# Altium schematic sheet Cpcis_connectors_P1_P2_P3.SchDoc: CPCIS Backplane
size 420 x 297 mm; CheckedBy: A.Paixao; CompanyName: CERN; DrawnBy: G. Daniluk; Engineer: G. Daniluk; Organization: CERN; Address1: European Organization for Nuclear Research; Address2: CH-1211 Genève 23 - Switzerland; DocumentNumber: 18; SheetNumber: 18; SheetTotal: 19; Title2: P1 to P4; DivGrp: BE/CO; Designer: G. Daniluk; EDA_Number: EDA-03828-V1-0; Projet: DIOT Demonstrator System Board (based on C-GEFE v1); ModifiedBy: G. Daniluk; CheckedDate: 18/06/2018; ProjectName: Distributed I/O Tier
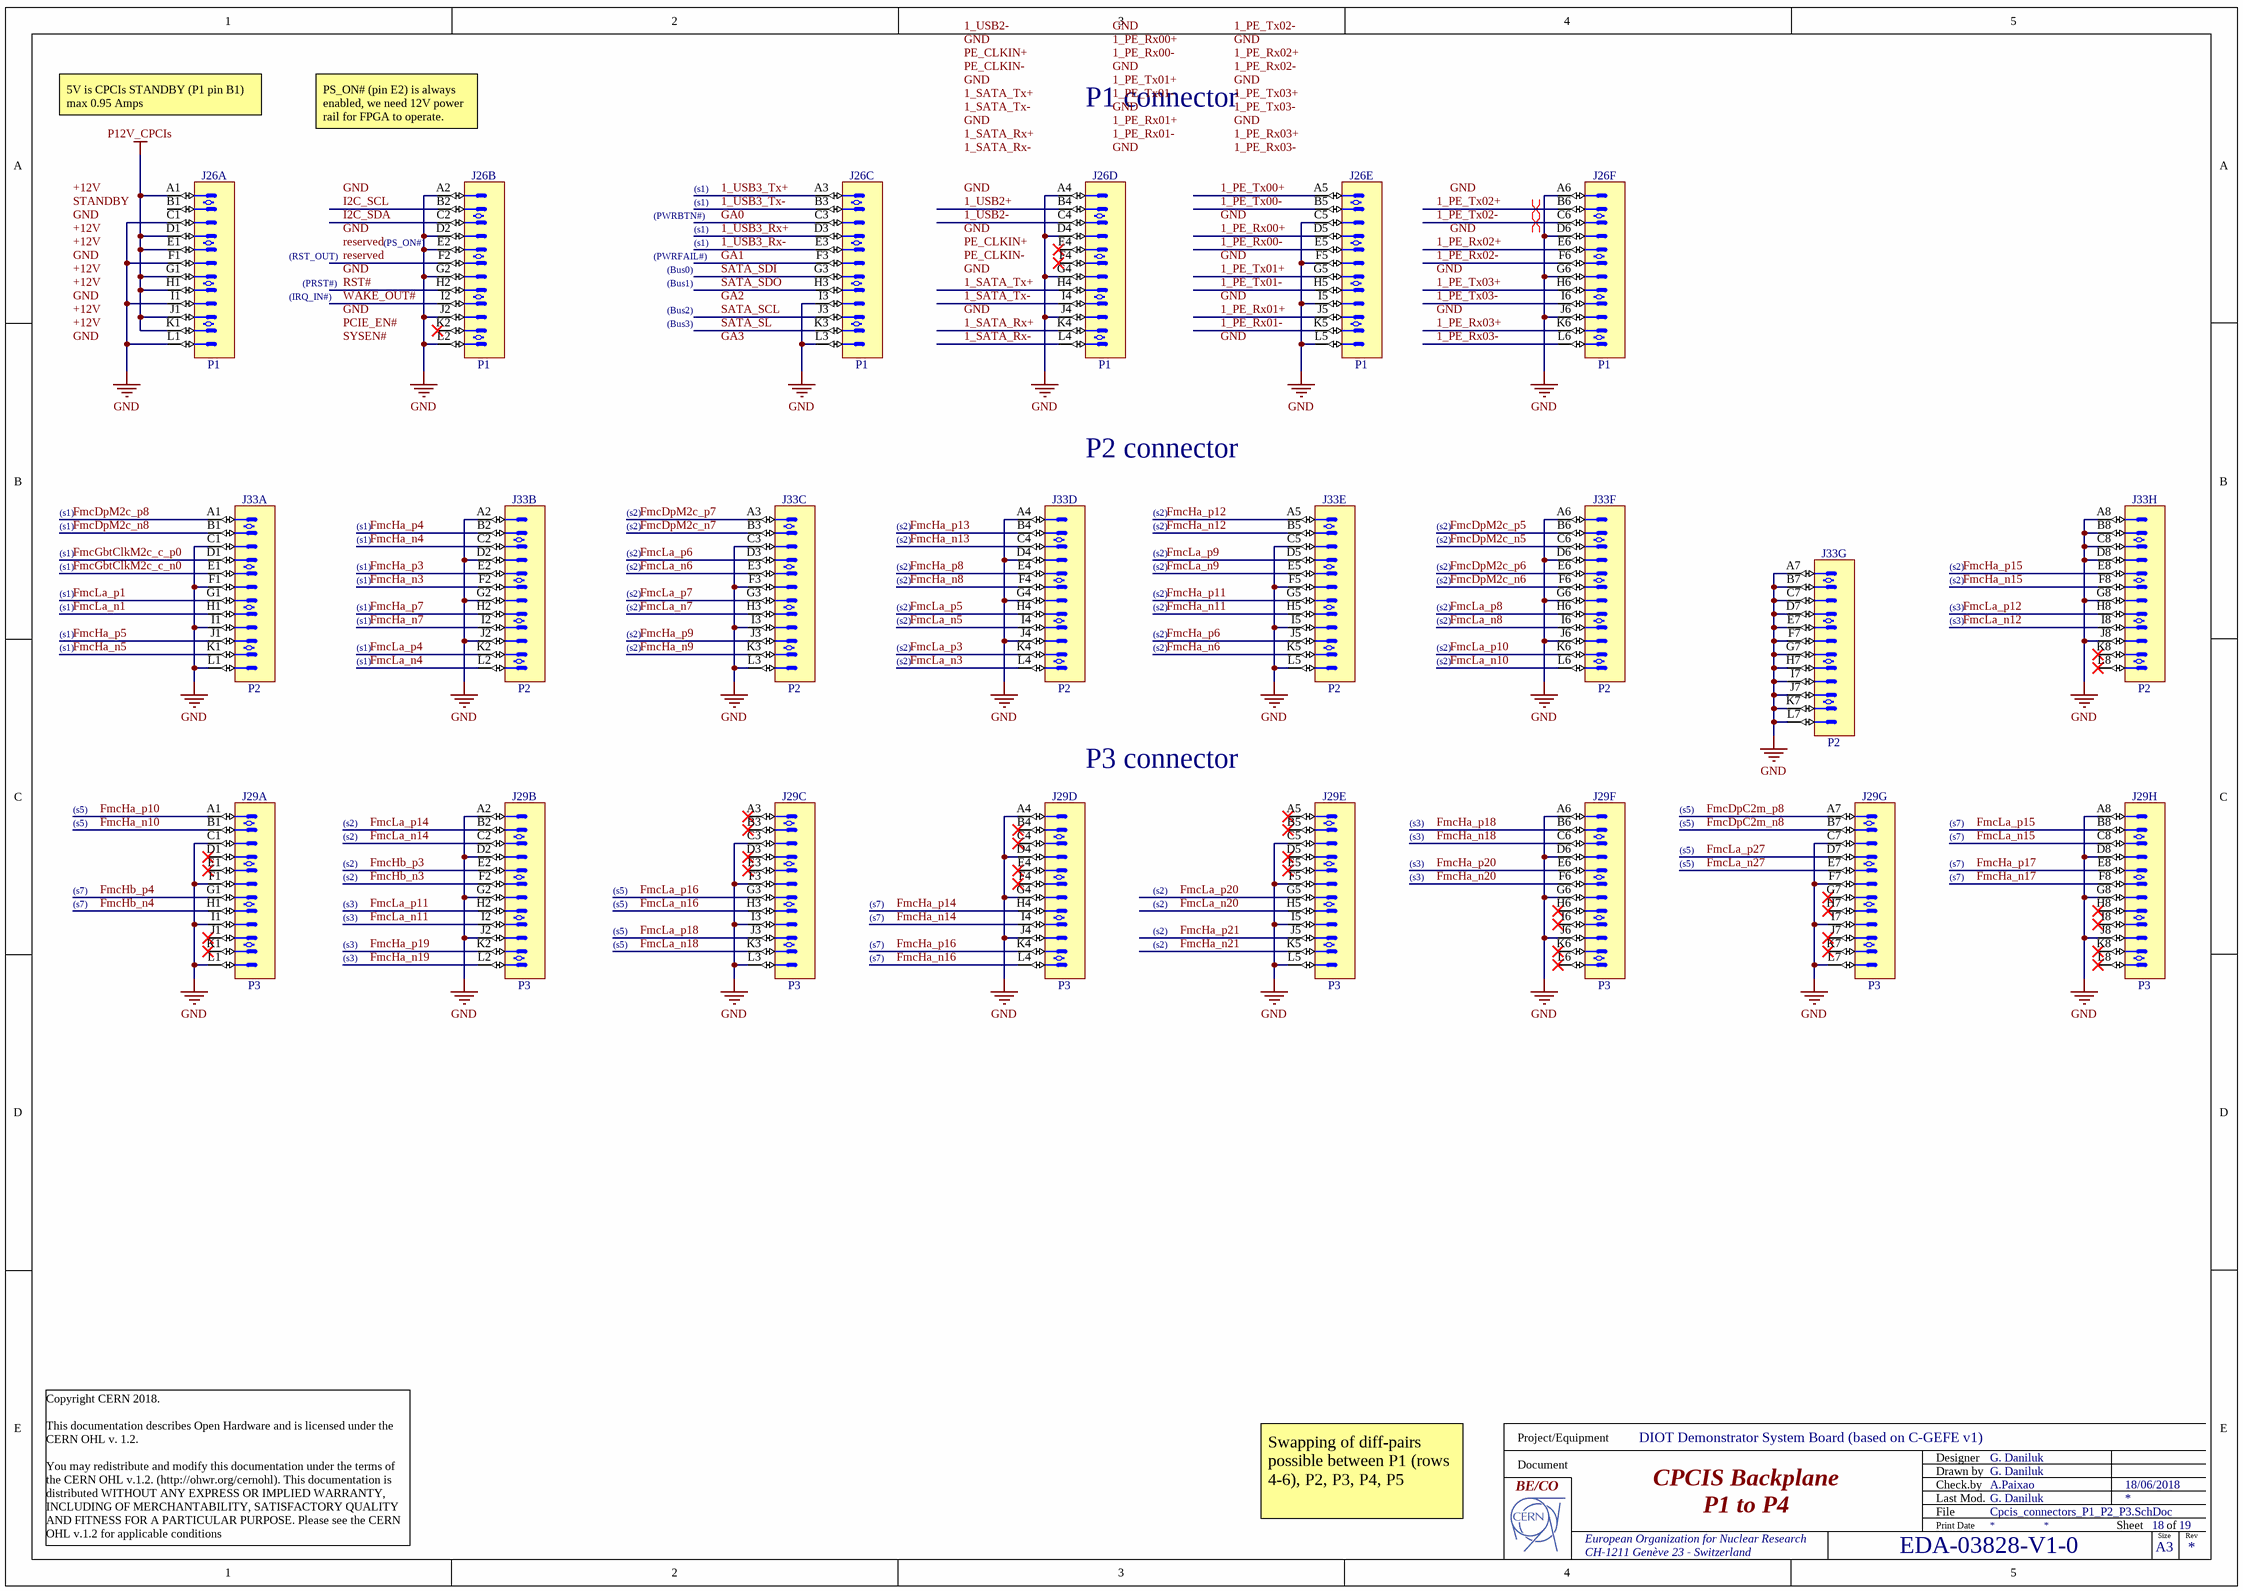
[diagram p0: Cpcis_connectors_P1_P2_P3.SchDoc]

## Parts
J26  P1  [AMPHENOL_10052825-101LF]  (parts A,B,C,D,E,F of 6)
J29  P3  [AMPHENOL_10052837-101LF]  (parts A,B,C,D,E,F,G,H of 8)
J33  P2  [AMPHENOL_10052837-101LF]  (parts A,B,C,D,E,F,G,H of 8)

## Nets
GND: J26.A2 J26.A4 J26.A6 J26.C1 J26.C5 J26.D2 J26.D4 J26.D6 J26.E2 J26.F1 J26.F5 J26.G2 J26.G4 J26.G6 J26.I1 J26.I3 J26.I5 J26.J2 J26.J4 J26.J6 J26.L1 J26.L2 J26.L3 J26.L5 J29.A2 J29.A4 J29.A6 J29.A8 J29.C1 J29.C3 J29.C5 J29.C7 J29.D2 J29.D4 J29.D6 J29.D8 J29.F1 J29.F3 J29.F5 J29.F7 J29.G2 J29.G4 J29.G6 J29.G8 J29.I1 J29.I3 J29.I5 J29.I7 J29.J2 J29.J4 J29.J6 J29.J8 J29.L1 J29.L3 J29.L5 J29.L7 J33.A2 J33.A4 J33.A6 J33.A7 J33.A8 J33.B7 J33.B8 J33.C1 J33.C3 J33.C5 J33.C7 J33.C8 J33.D2 J33.D4 J33.D6 J33.D7 J33.D8 J33.E7 J33.F1 J33.F3 J33.F5 J33.F7 J33.G2 J33.G4 J33.G6 J33.G7 J33.G8 J33.H7 J33.I1 J33.I3 J33.I5 J33.I7 J33.J2 J33.J4 J33.J6 J33.J7 J33.J8 J33.K7 J33.L1 J33.L3 J33.L5 J33.L7
P12V_CPCIs: J26.A1 J26.D1 J26.E1 J26.G1 J26.H1 J26.J1 J26.K1
1_PE_Rx00+: J26.D5
1_PE_Rx00-: J26.E5
1_PE_Rx01+: J26.J5
1_PE_Rx01-: J26.K5
1_PE_Rx02+: J26.E6
1_PE_Rx02-: J26.F6
1_PE_Rx03+: J26.K6
1_PE_Rx03-: J26.L6
1_PE_Tx00+: J26.A5
1_PE_Tx00-: J26.B5
1_PE_Tx01+: J26.G5
1_PE_Tx01-: J26.H5
1_PE_Tx02+: J26.B6
1_PE_Tx02-: J26.C6
1_PE_Tx03+: J26.H6
1_PE_Tx03-: J26.I6
1_SATA_Rx+: J26.K4
1_SATA_Rx-: J26.L4
1_SATA_Tx+: J26.H4
1_SATA_Tx-: J26.I4
1_USB2+: J26.B4
1_USB2-: J26.C4
1_USB3_Rx+: J26.D3
1_USB3_Rx-: J26.E3
1_USB3_Tx+: J26.A3
1_USB3_Tx-: J26.B3
FmcDpC2m_n8: J29.B7
FmcDpC2m_p8: J29.A7
FmcDpM2c_n5: J33.C6
FmcDpM2c_n6: J33.F6
FmcDpM2c_n7: J33.B3
FmcDpM2c_n8: J33.B1
FmcDpM2c_p5: J33.B6
FmcDpM2c_p6: J33.E6
FmcDpM2c_p7: J33.A3
FmcDpM2c_p8: J33.A1
FmcGbtClkM2c_c_n0: J33.E1
FmcGbtClkM2c_c_p0: J33.D1
FmcHa_n3: J33.F2
FmcHa_n4: J33.C2
FmcHa_n5: J33.K1
FmcHa_n6: J33.K5
FmcHa_n7: J33.I2
FmcHa_n8: J33.F4
FmcHa_n9: J33.K3
FmcHa_n10: J29.B1
FmcHa_n11: J33.H5
FmcHa_n12: J33.B5
FmcHa_n13: J33.C4
FmcHa_n14: J29.I4
FmcHa_n15: J33.F8
FmcHa_n16: J29.L4
FmcHa_n17: J29.F8
FmcHa_n18: J29.C6
FmcHa_n19: J29.L2
FmcHa_n20: J29.F6
FmcHa_n21: J29.K5
FmcHa_p3: J33.E2
FmcHa_p4: J33.B2
FmcHa_p5: J33.J1
FmcHa_p6: J33.J5
FmcHa_p7: J33.H2
FmcHa_p8: J33.E4
FmcHa_p9: J33.J3
FmcHa_p10: J29.A1
FmcHa_p11: J33.G5
FmcHa_p12: J33.A5
FmcHa_p13: J33.B4
FmcHa_p14: J29.H4
FmcHa_p15: J33.E8
FmcHa_p16: J29.K4
FmcHa_p17: J29.E8
FmcHa_p18: J29.B6
FmcHa_p19: J29.K2
FmcHa_p20: J29.E6
FmcHa_p21: J29.J5
FmcHb_n3: J29.F2
FmcHb_n4: J29.H1
FmcHb_p3: J29.E2
FmcHb_p4: J29.G1
FmcLa_n1: J33.H1
FmcLa_n3: J33.L4
FmcLa_n4: J33.L2
FmcLa_n5: J33.I4
FmcLa_n6: J33.E3
FmcLa_n7: J33.H3
FmcLa_n8: J33.I6
FmcLa_n9: J33.E5
FmcLa_n10: J33.L6
FmcLa_n11: J29.I2
FmcLa_n12: J33.I8
FmcLa_n14: J29.C2
FmcLa_n15: J29.C8
FmcLa_n16: J29.H3
FmcLa_n18: J29.K3
FmcLa_n20: J29.H5
FmcLa_n27: J29.E7
FmcLa_p1: J33.G1
FmcLa_p3: J33.K4
FmcLa_p4: J33.K2
FmcLa_p5: J33.H4
FmcLa_p6: J33.D3
FmcLa_p7: J33.G3
FmcLa_p8: J33.H6
FmcLa_p9: J33.D5
FmcLa_p10: J33.K6
FmcLa_p11: J29.H2
FmcLa_p12: J33.H8
FmcLa_p14: J29.B2
FmcLa_p15: J29.B8
FmcLa_p16: J29.G3
FmcLa_p18: J29.J3
FmcLa_p20: J29.G5
FmcLa_p27: J29.D7
GA0: J26.C3
GA1: J26.F3
I2C_SCL: J26.B2
I2C_SDA: J26.C2
reserved: J26.F2
RST#: J26.H2
SATA_SCL: J26.J3
SATA_SDI: J26.G3
SATA_SDO: J26.H3
SATA_SL: J26.K3
WAKE_OUT#: J26.I2

Not connected (* = marked no-connect by the designer): J26 B1 E4* F4* K2*; J29 A3* A5* B3* B4* B5* C4* D1* D3* D5* E1* E3* E4* E5* F4* G7* H6* H7* H8* I6* I8* J1* J7* K1* K6* K7* K8* L6* L8*; J33 K8* L8*

## Layout directives
differential pair: 1_PE_Tx02+, 1_PE_Tx02-

## Notes on the sheet
- 5V is CPCIs STANDBY (P1 pin B1)
  max 0.95 Amps
- PS_ON# (pin E2) is always enabled, we need 12V power rail for FPGA to operate.
- P1 connector
- (s1)
- (RST_OUT)
- (near J26) (PS_ON#)
- (PWRBTN#)
- (PWRFAIL#)
- (IRQ_IN#)
- (PRST#)
- (Bus0)
- (Bus1)
- (Bus2)
- (Bus3)
- P2 connector
- (s2)
- (s3)
- P3 connector
- (s5)
- (s7)
- Copyright CERN 2018.
  This documentation describes Open Hardware and is licensed under the CERN OHL v. 1.2.
  You may redistribute and modify this documentation under the terms of the CERN OHL v.1.2. (http://ohwr.org/cernohl). This documentation is distributed WITHOUT ANY EXPRESS OR IMPLIED WARRANTY, INCLUDING OF MERCHANTABILITY, SATISFACTORY QUALITY AND FITNESS FOR A PARTICULAR PURPOSE. Please see the CERN OHL v.1.2 for applicable conditions
- Swapping of diff-pairs possible between P1 (rows 4-6), P2, P3, P4, P5
- Labels drawn without touching a wire or pin: 1_PE_Rx00+, 1_PE_Rx00-, 1_PE_Rx01+, 1_PE_Rx01-, 1_PE_Rx02+, 1_PE_Rx02-, 1_PE_Rx03+, 1_PE_Rx03-, 1_PE_Tx01+, 1_PE_Tx01-, 1_PE_Tx02-, 1_PE_Tx03+, 1_PE_Tx03-, 1_SATA_Rx+, 1_SATA_Rx-, 1_SATA_Tx+, 1_SATA_Tx-, 1_USB2-, +12V, GA2, GA3, GND, PCIE_EN#, PE_CLKIN+, PE_CLKIN-, reserved, STANDBY, SYSEN#
- Project/Equipment
- Document
- Designer
- Drawn by
- Check.by
- File
- Last Mod.
- Print Date
- Sheet
- Size
- A3
- of
- Rev

## Library data of the parts
J26 = AMPHENOL_10052825-101LF: 72 Contacts Header, 6 Columns, 4 Pairs per Column; Part Description: 72 Contacts, 2mm Pitch, 6 Columns, 4 Pairs per Column, 4 Walls, Right Angle Header; Part Number: AMPHENOL_10052825-101LF; Component Kind: Standard; Component Type: Standard; Pin Count: 72; Family: AirMax VS; Mounted: Yes; Socket: No; SMD: No; PressFit: Yes; Sense: No; Status: None; Manufacturer: AMPHENOL; Manufacturer Part Number: 10052825-101LF; ComponentHeight: 15.35mm; HelpURL: \\cern.ch\dfs\Applications\Altium\Datasheets\AMPHENOL_10052825-101LF.pdf; ComponentLink1URL: \\cern.ch\dfs\Applications\Altium\Datasheets\AMPHENOL_10052825-101LF_Application.pdf; ComponentLink1Description: Application; Author: CERN DEM MR; CreateDate: 19/02/2018; LatestRevisionDate: 19/02/2018; Classname: Overlapping
J29 J33 = AMPHENOL_10052837-101LF: 96 Contacts Header, 8 Columns, 4 Pairs per Column; Part Description: 96 Contacts, 2mm Pitch, 8 Columns, 4 Pairs per Column, 2 Walls, Right Angle Header; Part Number: AMPHENOL_10052837-101LF; Component Kind: Standard; Component Type: Standard; Pin Count: 96; Family: AirMax VS; Mounted: Yes; Socket: No; SMD: No; PressFit: Yes; Sense: No; Status: None; Manufacturer: AMPHENOL; Manufacturer Part Number: 10052837-101LF; ComponentHeight: 15.35mm; HelpURL: \\cern.ch\dfs\Applications\Altium\Datasheets\AMPHENOL_10052837-101LF.pdf; ComponentLink1URL: \\cern.ch\dfs\Applications\Altium\Datasheets\AMPHENOL_10052837-101LF_Application.pdf; ComponentLink1Description: Application; Author: CERN DEM MR; CreateDate: 19/02/2018; LatestRevisionDate: 19/02/2018